# EAGLE schematic BATT_CPU (EAGLE 9.6.2)
COMPANY: ADAFRUIT INDUSTRIES; DRAWN: KTOWN; REV: B
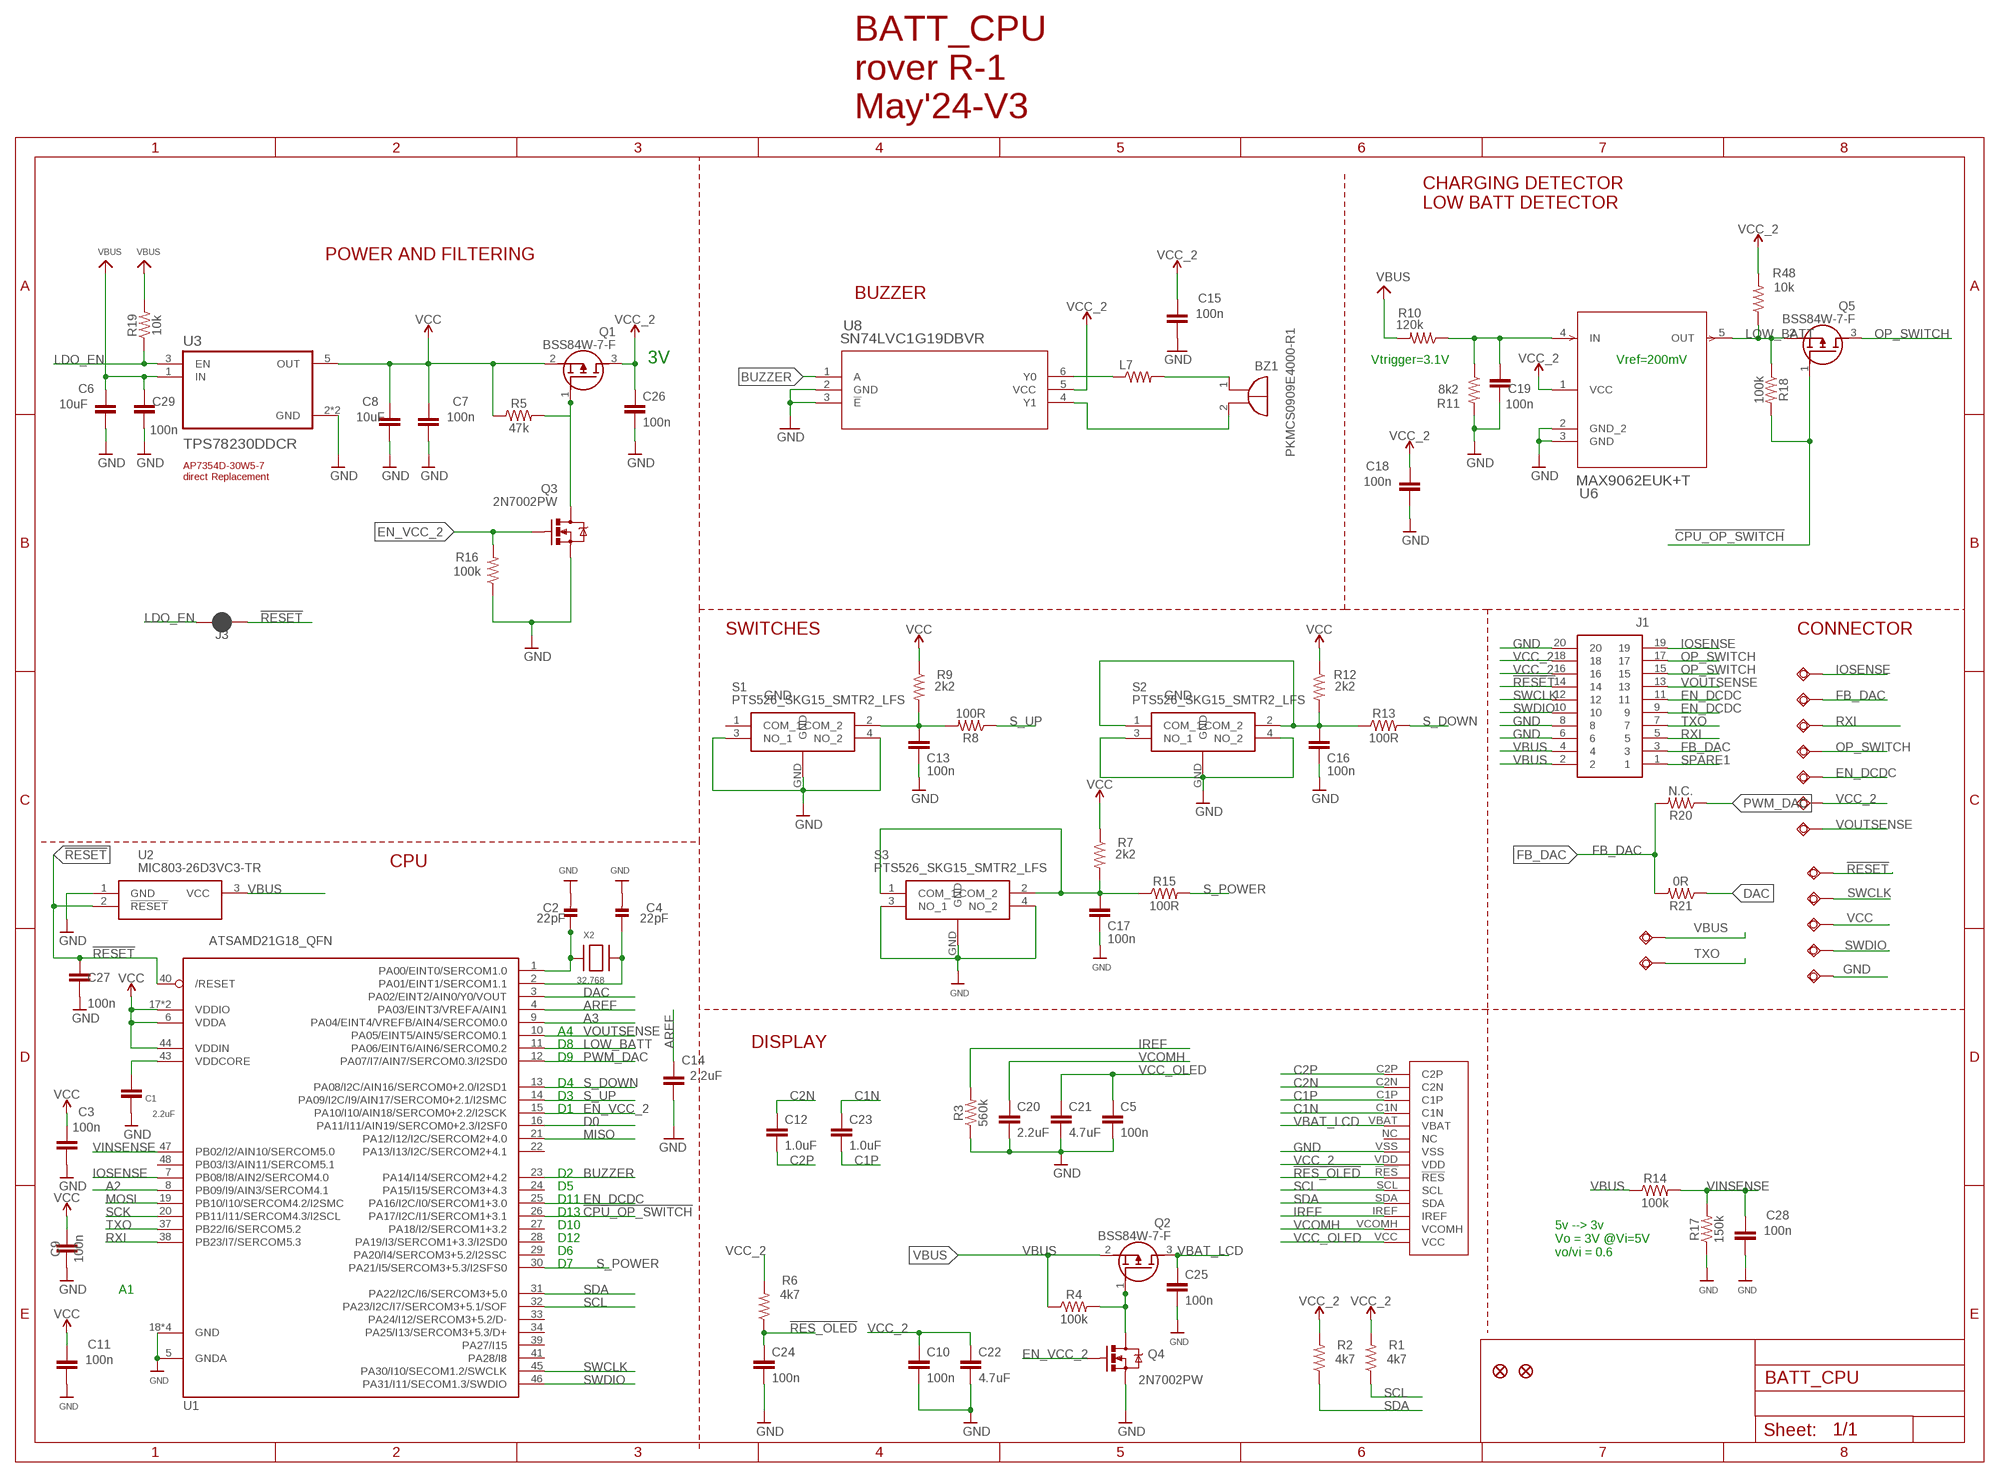
[diagram p0: schematic, sheet 1]

## Parts
BZ1  PKMCS0909E4000-R1  [PKMCS0909]
C1  2.2uF  2.2UF-0603-10V-20%  [0603]
C2  22pF  CAP_CERAMIC0603_NO  [0603-NO]
C3  100n  0.1UF-0402-16V-10%  [0402]
C4  22pF  CAP_CERAMIC0603_NO  [0603-NO]
C5  100n  0.1UF-0402-16V-10%  [0402]
C6  10uF  2.2UF-0603-10V-20%  [0603]
C7  100n  0.1UF-0402-16V-10%  [0402]
C8  10uF  2.2UF-0603-10V-20%  [0603]
C9  100n  0.1UF-0402-16V-10%  [0402]
C10  100n  0.1UF-0402-16V-10%  [0402]
C11  100n  0.1UF-0402-16V-10%  [0402]
C12  1.0uF  1.0UF-0402-16V-10%  [0402]
C13  100n  0.1UF-0402-16V-10%  [0402]
C14  2.2uF  2.2UF-0603-10V-20%  [0603]
C15  100n  0.1UF-0402-16V-10%  [0402]
C16  100n  0.1UF-0402-16V-10%  [0402]
C17  100n  0.1UF-0402-16V-10%  [0402]
C18  100n  0.1UF-0402-16V-10%  [0402]
C19  100n  0.1UF-0402-16V-10%  [0402]
C20  2.2uF  2.2UF-0603-10V-20%  [0603]
C21  4.7uF  4.7UF0603  [0603]
C22  4.7uF  4.7UF0603  [0603]
C23  1.0uF  1.0UF-0402-16V-10%  [0402]
C24  100n  0.1UF-0402-16V-10%  [0402]
C25  100n  0.1UF-0402-16V-10%  [0402]
C26  100n  0.1UF-0402-16V-10%  [0402]
C27  100n  0.1UF-0402-16V-10%  [0402]
C28  100n  0.1UF-0402-16V-10%  [0402]
C29  100n  0.1UF-0402-16V-10%  [0402]
EN_DCDC  TESTPAD_TPSQB1,27  [TESTPAD_B1,27]
FB_DAC  TESTPAD_TPSQB1,27  [TESTPAD_B1,27]
IOSENSE  TESTPAD_TPSQB1,27  [TESTPAD_B1,27]
J1  DF40C_2.0_-20DS-0.4V_51_  [DF40C2020DS04V51]
J3  N.C  JUMPER-SMT_2_NC_PASTE_SILK  [SMT-JUMPER_2_NC_PASTE_SILK]
L7  MMZ2012Y202BT000  RESISTOR0805-RES  [0805]
OP_SWITCH  TESTPAD_TPSQB1,27  [TESTPAD_B1,27]
Q1  BSS84W-7-F  [SOT65P222X110-3N]
Q2  BSS84W-7-F  [SOT65P222X110-3N]
Q3  2N7002PW  MOSFET-NCHANNEL2N7002PW  [SOT323]
Q4  2N7002PW  MOSFET-NCHANNEL2N7002PW  [SOT323]
Q5  BSS84W-7-F  [SOT65P222X110-3N]
R1  4k7  RESISTOR0402  [0402]
R2  4k7  RESISTOR0402  [0402]
R3  560k  RESISTOR0402  [0402]
R4  100k  RESISTOR0402  [0402]
R5  47k  RESISTOR0402  [0402]
R6  4k7  RESISTOR0402  [0402]
R7  2k2  RESISTOR0402  [0402]
R8  100R  RESISTOR0402  [0402]
R9  2k2  RESISTOR0402  [0402]
R10  120k  RESISTOR0402  [0402]
R11  8k2  RESISTOR0402  [0402]
R12  2k2  RESISTOR0402  [0402]
R13  100R  RESISTOR0402  [0402]
R14  100k  RESISTOR0402  [0402]
R15  100R  RESISTOR0402  [0402]
R16  100k  RESISTOR0402  [0402]
R17  150k  RESISTOR0402  [0402]
R18  100k  RESISTOR0402  [0402]
R19  10k  RESISTOR0402  [0402]
R20  N.C.  RESISTOR0402  [0402]
R21  0R  RESISTOR0402  [0402]
R48  10k  RESISTOR0402  [0402]
RXI  TESTPAD_TPSQB1,27  [TESTPAD_B1,27]
S1  PTS526_SKG15_SMTR2_LFS  [PTS526SKG15SMTR2LFS]
S2  PTS526_SKG15_SMTR2_LFS  [PTS526SKG15SMTR2LFS]
S3  PTS526_SKG15_SMTR2_LFS  [PTS526SKG15SMTR2LFS]
U1  ATSAMD21G18_QFN  ATSAMD21J_QFN  [TQFN48_7MM]
U2  MIC803-26D3VC3-TR  [SOT65P210X110-3N]
U3  TPS78230DDCR  [SOT95P280X110-5N]
U6  MAX9062EUK+T  [21-0057F_MXM]
U8  SN74LVC1G19DBVR  [DBV6]
U$30  64X32_OLED_049  [LCD_14_PINS]
U$34  FIDUCIAL""  [FIDUCIAL_1MM]
U$35  FIDUCIAL""  [FIDUCIAL_1MM]
VBUS  TESTPAD_TPSQB1,27  [TESTPAD_B1,27]
VBUS1  TESTPAD_TPSQB1,27  [TESTPAD_B1,27]
VBUS2  TESTPAD_TPSQB1,27  [TESTPAD_B1,27]
VBUS3  TESTPAD_TPSQB1,27  [TESTPAD_B1,27]
VBUS4  TESTPAD_TPSQB1,27  [TESTPAD_B1,27]
VBUS5  TESTPAD_TPSQB1,27  [TESTPAD_B1,27]
VBUS6  TESTPAD_TPSQB1,27  [TESTPAD_B1,27]
VCC_2  TESTPAD_TPSQB1,27  [TESTPAD_B1,27]
VOUTSENSE  TESTPAD_TPSQB1,27  [TESTPAD_B1,27]
X2  32.768  XTAL-3.2X1.5  [XTAL3215]

## Nets
!CPU_OP_SWITCH: Q5.1(G) R18.2 U1.26(PA17/I2C/I1/SERCOM1+3.1)
!RES_OLED: C24.1 R6.1 U$30.!RES
!RESET: C27.1 J1.14 J3.1 U1.40(/RESET) U2.2(!RESET) VBUS1.TP
A2: U1.8(PB09/I9/AIN3/SERCOM4.1)
A3: U1.9(PA04/EINT4/VREFB/AIN4/SERCOM0.0)
AREF: C14.1 U1.4(PA03/EINT3/VREFA/AIN1)
BUZZER: U1.23(PA14/I14/SERCOM2+4.2) U8.1(A)
C1N: C23.1 U$30.C1N
C1P: C23.2 U$30.C1P
C2N: C12.1 U$30.C2N
C2P: C12.2 U$30.C2P
D0: U1.16(PA11/I11/AIN19/SERCOM0+2.3/I2SF0)
DAC: R21.1 U1.3(PA02/EINT2/AIN0/Y0/VOUT)
EN_DCDC: EN_DCDC.TP J1.9 J1.11 U1.25(PA16/I2C/I0/SERCOM1+3.0)
EN_VCC_2: Q3.1(G) Q4.1(G) R16.2 U1.15(PA10/I10/AIN18/SERCOM0+2.2/I2SCK)
FB_DAC: FB_DAC.TP J1.3 R20.2 R21.2
GND: C1.2 C2.2 C3.2 C4.2 C5.2 C6.2 C7.2 C8.2 C9.2 C10.2 C11.2 C13.2 C14.2 C15.2 C16.2 C17.2 C18.2 C19.2 C20.2 C21.2 C22.2 C24.2 C25.2 C26.2 C27.2 C28.2 C29.2 J1.6 J1.8 J1.20 Q3.2(S) Q4.2(S) R3.1 R11.2 R16.1 R17.1 S1.3(NO_1) S1.4(NO_2) S1.GND S2.3(NO_1) S2.4(NO_2) S2.GND S3.3(NO_1) S3.4(NO_2) S3.GND U1.5(GNDA) U1.18(GND) U1.35(GND) U1.42(GND) U1.THERMAL(GND) U2.1(GND) U3.2(GND) U3.4(GND) U6.2(GND_2) U6.3(GND) U8.2(GND) U8.3(!E) U$30.VSS VBUS4.TP
IOSENSE: IOSENSE.TP J1.19 U1.7(PB08/I8/AIN2/SERCOM4.0)
IREF: R3.2 U$30.IREF
LDO_EN: J3.2 R19.1 U3.3(EN)
LOW_BATT: Q5.2(S) R18.1 R48.1 U1.11(PA06/EINT6/AIN6/SERCOM0.2) U6.5(OUT)
MISO: U1.21(PA12/I12/I2C/SERCOM2+4.0)
MOSI: U1.19(PB10/I10/SERCOM4.2/I2SMC)
N$1: C17.1 R7.2 R15.1 S3.1(COM_1) S3.2(COM_2)
N$2: C13.1 R8.2 R9.2 S1.2(COM_2)
N$3: C16.1 R12.2 R13.1 S2.1(COM_1) S2.2(COM_2)
N$4: Q2.1(G) Q4.3(D) R4.2
N$5: C2.1 U1.1(PA00/EINT0/SERCOM1.0) X2.P$1
N$6: Q1.1(G) Q3.3(D) R5.2
N$7: C4.1 U1.2(PA01/EINT1/SERCOM1.1) X2.P$2
N$10: C19.1 R10.1 R11.1 U6.4(IN)
N$17: L7.1 U8.6(Y0)
N$19: BZ1.1(+) L7.2
N$22: BZ1.2(-) U8.4(Y1)
OP_SWITCH: J1.15 J1.17 OP_SWITCH.TP Q5.3(D)
PWM_DAC: R20.1 U1.12(PA07/I7/AIN7/SERCOM0.3/I2SD0)
RXI: J1.5 RXI.TP U1.38(PB23/I7/SERCOM5.3)
S_DOWN: R13.2 U1.13(PA08/I2C/AIN16/SERCOM0+2.0/I2SD1)
S_POWER: R15.2 U1.30(PA21/I5/SERCOM3+5.3/I2SFS0)
S_UP: R8.1 U1.14(PA09/I2C/I9/AIN17/SERCOM0+2.1/I2SMC)
SCK: U1.20(PB11/I11/SERCOM4.3/I2SCL)
SCL: R1.1 U1.32(PA23/I2C/I7/SERCOM3+5.1/SOF) U$30.SCL
SDA: R2.1 U1.31(PA22/I2C/I6/SERCOM3+5.0) U$30.SDA
SPARE1: J1.1
SWCLK: J1.12 U1.45(PA30/I10/SECOM1.2/SWCLK) VBUS2.TP
SWDIO: J1.10 U1.46(PA31/I11/SECOM1.3/SWDIO) VBUS3.TP
TXO: J1.7 U1.37(PB22/I6/SERCOM5.2) VBUS6.TP
VBAT_LCD: C25.1 Q2.3(D) U$30.VBAT
VBUS: C6.1 C29.1 J1.2 J1.4 Q2.2(S) R4.1 R10.2 R14.1 R19.2 U2.3(VCC) U3.1(IN) VBUS5.TP
VCC: C3.1 C7.1 C8.1 C9.1 C11.1 Q1.2(S) R5.1 R7.1 R9.1 R12.1 R48.2 U1.6(VDDA) U1.17(VDDIO) U1.36(VDDIO) U1.44(VDDIN) U3.5(OUT) VBUS.TP ; supply symbol labelled VCC_2
VCC_2: C10.1 C15.1 C18.1 C22.1 C26.1 J1.16 J1.18 Q1.3(D) R1.2 R2.2 R6.2 U6.1(VCC) U8.5(VCC) U$30.VDD VCC_2.TP
VCC_OLED: C5.1 C21.1 U$30.VCC
VCOMH: C20.1 U$30.VCOMH
VDDCORE: C1.1 U1.43(VDDCORE)
VINSENSE: C28.1 R14.2 R17.2 U1.47(PB02/I2/AIN10/SERCOM5.0)
VOUTSENSE: J1.13 U1.10(PA05/EINT5/AIN5/SERCOM0.1) VOUTSENSE.TP
Unconnected: S1.1(COM_1) U1.22(PA13/I13/I2C/SERCOM2+4.1) U1.24(PA15/I15/SERCOM3+4.3) U1.27(PA18/I2/SERCOM1+3.2) U1.28(PA19/I3/SERCOM1+3.3/I2SD0) U1.29(PA20/I4/SERCOM3+5.2/I2SSC) U1.33(PA24/I12/SERCOM3+5.2/D-) U1.34(PA25/I13/SERCOM3+5.3/D+) U1.39(PA27/I15) U1.41(PA28/I8) U1.48(PB03/I3/AIN11/SERCOM5.1) U$30.NC

## Notes on the sheet
- BATT_CPU
  rover R-1
  May'24-V3
- CHARGING DETECTOR
  LOW BATT DETECTOR
- POWER AND FILTERING
- BUZZER
- 3V | Vtrigger=3.1V | Vref=200mV
- AP7354D-30W5-7 
  direct Replacement
- SWITCHES | CONNECTOR
- CPU
- A4
- D8 | DISPLAY
- D9
- D4
- D3
- D1
- D2
- D5
- D11
- D13
- D10
- D12
- D6
- D7
- 5v --> 3v
  Vo = 3V @Vi=5V
  vo/vi = 0.6
- A1

## Library data of the parts
BZ1 = buzzer:PKMCS0909E4000-R1: PKMCS0909E4000-R1 Source : http://www.murata.com/~/media/webrenewal/products/sound/sounder/vppt-buzj083-d.ashx
C1 C14 C20 = SparkFun-Capacitors:2.2UF: 2.2µF ceramic capacitors A capacitor is a passive two-terminal electrical component used to store electrical energy temporarily in an electric field.; PROD_ID: CAP-07888
C2 C4 = microbuilder:CAP_CERAMIC: Ceramic Capacitors For new designs, use the packages preceded by an '_' character since they are more reliable: The following footprints should be used on most boards: _0402 - Standard footprint for regular board layouts _0603 - Standard footprint for regular board layouts _0805 - Standard footprint for regular board layouts _1206 - Standard footprint for regular board layouts For extremely tight-pitch boards where space is at a premium, the following 'micro-pitch' footprints can be used (smaller pads, no silkscreen outline, etc.): _0402MP - Micro-pitch footprint for very dense/compact boards _0603MP - Micro-pitch footprint for very dense/compact boards _0805MP - Micro-pitch footprint for very dense/compact boards _1206MP - Micro-pitch footprint for very dense/compact boards
C3 C5 C7 C9-C11 C13 C15-C19 C24-C29 = SparkFun-Capacitors:0.1UF: 0.1µF ceramic capacitors A capacitor is a passive two-terminal electrical component used to store electrical energy temporarily in an electric field.; PROD_ID: CAP-12416; VALUE: 0.1uF
C6 C8 = SparkFun-Capacitors:2.2UF: 2.2µF ceramic capacitors A capacitor is a passive two-terminal electrical component used to store electrical energy temporarily in an electric field.; PROD_ID: CAP-07888; VALUE: 2.2uF
C12 C23 = SparkFun-Capacitors:1.0UF: 1µF ceramic capacitors A capacitor is a passive two-terminal electrical component used to store electrical energy temporarily in an electric field.; PROD_ID: CAP-12417
C21 C22 = SparkFun-Capacitors:4.7UF: 4.7µF ceramic capacitors A capacitor is a passive two-terminal electrical component used to store electrical energy temporarily in an electric field.; PROD_ID: CAP-08280
EN_DCDC FB_DAC IOSENSE OP_SWITCH RXI VBUS VBUS1-VBUS6 VCC_2 VOUTSENSE = BeagleBone_Blue_R3:TESTPAD_TPSQ: Test pad
J1 = DF40C_2.0_-20DS-0.4V_51_:DF40C_2.0_-20DS-0.4V_51_: Board to Board & Mezzanine Connectors 20P 2-ROW RECEPT VERT SMT 2.0MM HGHT Source: Datasheet <https://www.hirose.com/product/document?clcode=CL0684-4003-3-51&productname=DF40C-60DP-0.4V(51)&series=DF40&documenttype=Catalog&lang=en&documentid=D31649_en>; DESCRIPTION: Board to Board & Mezzanine Connectors 20P 2-ROW RECEPT VERT SMT 2.0MM HGHT; HEIGHT: 2.1mm; MANUFACTURER_NAME: Hirose; MANUFACTURER_PART_NUMBER: DF40C(2.0)-20DS-0.4V(51); MOUSER_PART_NUMBER: 798-DF40C2020DS04V51; MOUSER_PRICE-STOCK: https://www.mouser.co.uk/ProductDetail/Hirose-Connector/DF40C2.0-20DS-0.4V51?qs=3aug5cyrIbdA5dYbMRd5pw%3D%3D
J3 = SparkFun-Jumpers:JUMPER-SMT_2_NC_PASTE: Normally closed solder jumper This jumper has an aperture in the stencil to allow solder paste to bridge the split in the wire so it's normally closed (NC). Wick off the solder to open the connection. Reapply solder to reclose the connection.
L7 = SparkFun:RESISTOR: Resistor Basic schematic elements and footprints for 0603, 1206, and PTH resistors.
Q1 Q2 Q5 = BSS84W-7-F:BSS84W-7-F: Lattice Source: Datasheet <https://www.diodes.com/assets/Datasheets/BSS84W.pdf>; DESCRIPTION: Lattice; HEIGHT: 1.1mm; MANUFACTURER_NAME: Lattice Semiconductor; MANUFACTURER_PART_NUMBER: BSS84W-7-F; MOUSER_PART_NUMBER: N/A; MOUSER_PRICE-STOCK: https://www.mouser.com/Search/Refine.aspx?Keyword=N%2FA
Q3 Q4 = SparkFun-DiscreteSemi:MOSFET-NCHANNEL: Common NMOSFET Parts MFG P/N Store ID Prod ID FDD8780 TRANS-09984 SI7820DN TRANS-11055 FDS6630A IC-08089 2N7002PW TRANS-11151 FQP30N06L COM-10213 TRANS-10060 BSS123LT1G TRANS-08345 BSS138 TRANS-00830 BS170 2N7000; PROD_ID: TRANS-11151
R1-R21 R48 = SparkFun-Resistors:RESISTOR: Generic Resistor Package
S1-S3 = PTS526_SKG15_SMTR2_LFS:PTS526_SKG15_SMTR2_LFS: Tact 5.2 x 5.2, 1.5 mm H, 260gf, G leads, Ground pin, metal actuator Source: Datasheet <https://www.arrow.com/en/products/pts526-skg15-smtr2-lfs/ck>; ARROW_PART_NUMBER: PTS526 SKG15 SMTR2 LFS; ARROW_PRICE-STOCK: https://www.arrow.com/en/products/pts526-skg15-smtr2-lfs/ck?region=nac; DESCRIPTION: Tact 5.2 x 5.2, 1.5 mm H, 260gf, G leads, Ground pin, metal actuator; HEIGHT: 1.6mm; MANUFACTURER_NAME: C & K COMPONENTS; MANUFACTURER_PART_NUMBER: PTS526 SKG15 SMTR2 LFS; MOUSER_PART_NUMBER: 611-PTS526SKG15SMR2L; MOUSER_PRICE-STOCK: https://www.mouser.co.uk/ProductDetail/CK/PTS526-SKG15-SMTR2-LFS?qs=UXgszm6BlbEc7nn5s4cd2Q%3D%3D
U1 = microbuilder:ATSAMD21J
U2 = MIC803-26D3VC3-TR:MIC803-26D3VC3-TR: Supervisory Circuits Source: Datasheet <https://www.mouser.com/datasheet/2/268/mic803-778690.pdf>; DESCRIPTION: Supervisory Circuits; HEIGHT: 1.1mm; MANUFACTURER_NAME: Microchip; MANUFACTURER_PART_NUMBER: MIC803-26D3VC3-TR; MOUSER_PART_NUMBER: 998-MIC803-26D3VC3TR; MOUSER_PRICE-STOCK: https://www.mouser.co.uk/ProductDetail/Microchip-Technology-Micrel/MIC803-26D3VC3-TR?qs=Y3Q3JoKAO1QfnxnYOR7kig%3D%3D
U3 = TPS78230DDCR:TPS78230DDCR: Check prices <https://pricing.snapeda.com/parts/TPS78230DDCR/Texas%20Instruments/view-part?ref=eda>; AVAILABILITY: Good; DESCRIPTION: 150-mA, nano-IQ, low-dropout voltage regulator with enable from -40C to +125C 5-SOT-23-THIN -40 to 125; MF: Texas Instruments; MP: TPS78230DDCR; PACKAGE: SOT-23-THN-5 Texas Instruments; PRICE: None; PURCHASE-URL: https://pricing.snapeda.com/search/part/TPS78230DDCR/?ref=eda
U6 = MAX9062:MAX9062EUK+T; BUILT_BY: EMA_UL_Team; MANUFACTURER_PART_NUMBER: MAX9062EUK+T; SOURCELIBRARY: Maxim_2014-06-20; VENDOR: Maxim Integrated Products
U8 = SN74LVC1G19DBVR:SN74LVC1G19DBVR; DATASHEET_URL: http://www.ti.com/lit/gpn/SN74LVC1G19; DESCRIPTION: 1-of-2 Decoder/Demultiplexer; FAMILY_NAME: LL Decoder, Mux/Demux; GENERIC_PART_NUMBER: SN74LVC1G19; INDUSTRY_STD_PKG_TYPE: SOT-23; MANUFACTURER: Texas Instruments; MANUFACTURER_PART_NUMBER: SN74LVC1G19DBVR; PACKAGE_DESIGNATOR: DBV; PIN_COUNT: 6; VENDOR: Texas Instruments
U$30 = OLED 66 64x48:64X32_OLED_049
U$34 U$35 = microbuilder:FIDUCIAL: Fiducial Alignment Points Various fiducial points for machine vision alignment.; BOM: EXCLUDE
X2 = adafruit2:XTAL: Low cost SMT crystals, no capacitors included http://www.ladyada.net/library/eagle

## Net classes
2 gnd: width 0.305 mm, drill 0.483 mm, clearance 0.203 mm